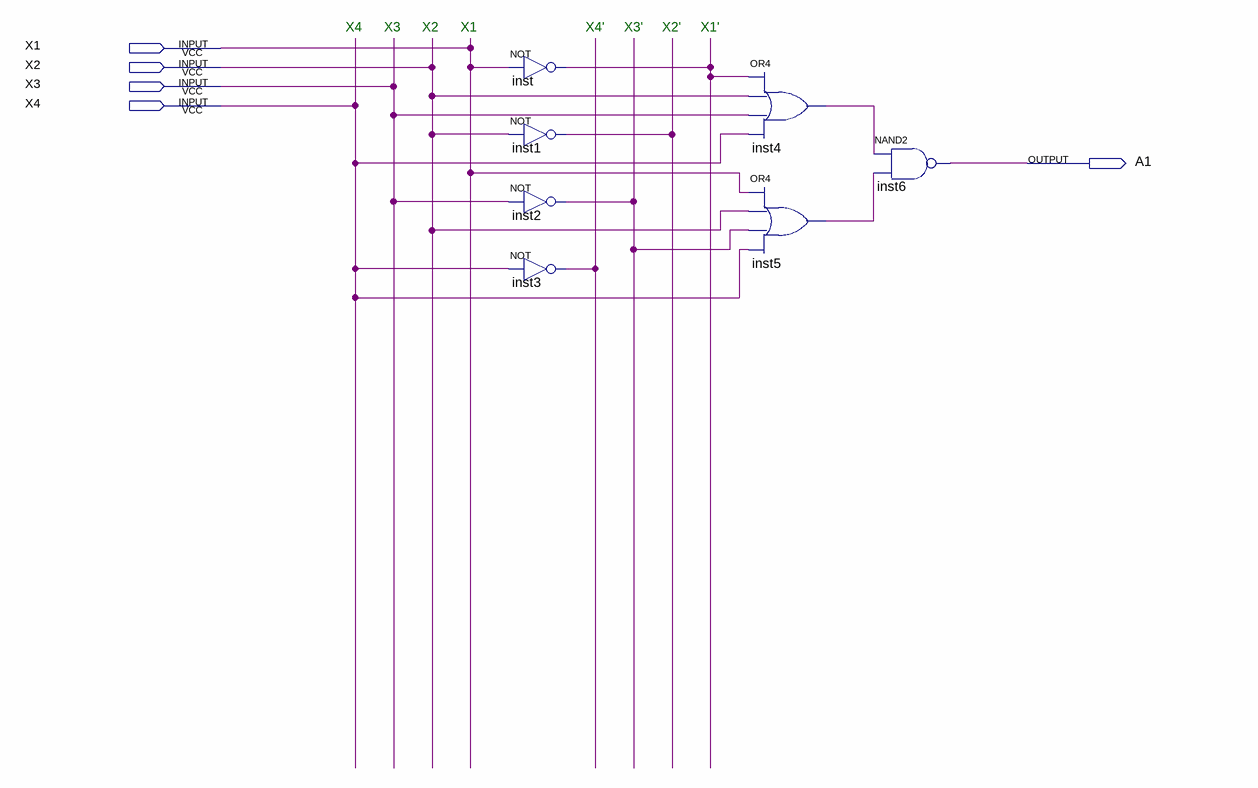
[diagram p0: schematic sheet]
// Quartus schematic Block3.bdf as structural Verilog: 7 symbols, 5 pins
module Block3 (
  input  X1,
  input  X2,
  input  X3,
  input  X4,
  output A1
);

  wire inst1_out, inst2_out, inst3_out, inst4_out, inst5_out, inst_out;

  not inst (inst_out, X1);
  not inst1 (inst1_out, X2);
  not inst2 (inst2_out, X3);
  not inst3 (inst3_out, X4);
  or inst4 (inst4_out, inst_out, X2, X3, X4);
  or inst5 (inst5_out, X1, X2, inst2_out, X4);
  nand inst6 (A1, inst4_out, inst5_out);

  // Notes on the sheet:
  //   X4
  //   X3
  //   X2
  //   X1
  //   X4'
  //   X3'
  //   X2'
  //   X1'
endmodule
